# Vivado block design finn_design, xck26-sfvc784-2LV-c, Vivado 2022.2
create_bd_design finn_design

create_bd_intf_port -mode Slave -vlnv xilinx.com:interface:axis_rtl:1.0 s_axis_0
set_property -dict [list \
  CONFIG.FREQ_HZ 200000000 \
  CONFIG.HAS_TKEEP 0 \
  CONFIG.HAS_TLAST 0 \
  CONFIG.HAS_TREADY 1 \
  CONFIG.HAS_TSTRB 0 \
  CONFIG.LAYERED_METADATA undef \
  CONFIG.TDATA_NUM_BYTES 2 \
  CONFIG.TDEST_WIDTH 0 \
  CONFIG.TID_WIDTH 0 \
  CONFIG.TUSER_WIDTH 0 \
] [get_bd_intf_ports s_axis_0]
create_bd_intf_port -mode Master -vlnv xilinx.com:interface:axis_rtl:1.0 m_axis_0
set_property -dict {CONFIG.FREQ_HZ 200000000} [get_bd_intf_ports m_axis_0]
create_bd_port -dir I -type clk ap_clk
set_property -dict {CONFIG.FREQ_HZ 200000000} [get_bd_ports ap_clk]
create_bd_port -dir I -type rst ap_rst_n

create_bd_cell -type module -reference StreamingFIFO_rtl_0 StreamingFIFO_rtl_0
create_bd_cell -type module -reference FMPadding_rtl_0 FMPadding_rtl_0
create_bd_cell -type hier StreamingFIFO_rtl_1
create_bd_cell -type module -reference ConvolutionInputGenerator_rtl_0 ConvolutionInputGenerator_rtl_0
create_bd_cell -type module -reference StreamingFIFO_rtl_2 StreamingFIFO_rtl_2
create_bd_cell -type module -reference StreamingDataWidthConverter_rtl_0 StreamingDataWidthConverter_rtl_0
create_bd_cell -type module -reference StreamingFIFO_rtl_3 StreamingFIFO_rtl_3
create_bd_cell -type hier MVAU_hls_0
create_bd_cell -type module -reference StreamingFIFO_rtl_4 StreamingFIFO_rtl_4
create_bd_cell -type module -reference StreamingDataWidthConverter_rtl_1 StreamingDataWidthConverter_rtl_1
create_bd_cell -type module -reference StreamingFIFO_rtl_5 StreamingFIFO_rtl_5
create_bd_cell -type ip -vlnv xilinx.com:hls:StreamingMaxPool_hls_0:1.0 StreamingMaxPool_hls_0
create_bd_cell -type module -reference StreamingFIFO_rtl_6 StreamingFIFO_rtl_6
create_bd_cell -type module -reference FMPadding_rtl_1 FMPadding_rtl_1
create_bd_cell -type module -reference StreamingFIFO_rtl_7 StreamingFIFO_rtl_7
create_bd_cell -type module -reference StreamingDataWidthConverter_rtl_2 StreamingDataWidthConverter_rtl_2
create_bd_cell -type hier StreamingFIFO_rtl_8
create_bd_cell -type module -reference ConvolutionInputGenerator_rtl_1 ConvolutionInputGenerator_rtl_1
create_bd_cell -type module -reference StreamingFIFO_rtl_9 StreamingFIFO_rtl_9
create_bd_cell -type module -reference StreamingDataWidthConverter_rtl_3 StreamingDataWidthConverter_rtl_3
create_bd_cell -type hier StreamingFIFO_rtl_10
create_bd_cell -type hier MVAU_hls_1
create_bd_cell -type module -reference StreamingFIFO_rtl_11 StreamingFIFO_rtl_11
create_bd_cell -type module -reference StreamingDataWidthConverter_rtl_4 StreamingDataWidthConverter_rtl_4
create_bd_cell -type module -reference StreamingFIFO_rtl_12 StreamingFIFO_rtl_12
create_bd_cell -type ip -vlnv xilinx.com:hls:StreamingMaxPool_hls_1:1.0 StreamingMaxPool_hls_1
create_bd_cell -type module -reference StreamingFIFO_rtl_13 StreamingFIFO_rtl_13
create_bd_cell -type module -reference FMPadding_rtl_2 FMPadding_rtl_2
create_bd_cell -type module -reference StreamingFIFO_rtl_14 StreamingFIFO_rtl_14
create_bd_cell -type module -reference StreamingDataWidthConverter_rtl_5 StreamingDataWidthConverter_rtl_5
create_bd_cell -type module -reference StreamingFIFO_rtl_15 StreamingFIFO_rtl_15
create_bd_cell -type module -reference ConvolutionInputGenerator_rtl_2 ConvolutionInputGenerator_rtl_2
create_bd_cell -type module -reference StreamingFIFO_rtl_16 StreamingFIFO_rtl_16
create_bd_cell -type module -reference StreamingDataWidthConverter_rtl_6 StreamingDataWidthConverter_rtl_6
create_bd_cell -type hier StreamingFIFO_rtl_17
create_bd_cell -type hier MVAU_hls_2
create_bd_cell -type module -reference StreamingFIFO_rtl_18 StreamingFIFO_rtl_18
create_bd_cell -type module -reference StreamingDataWidthConverter_rtl_7 StreamingDataWidthConverter_rtl_7
create_bd_cell -type module -reference StreamingFIFO_rtl_19 StreamingFIFO_rtl_19
create_bd_cell -type ip -vlnv xilinx.com:hls:StreamingMaxPool_hls_2:1.0 StreamingMaxPool_hls_2
create_bd_cell -type module -reference StreamingFIFO_rtl_20 StreamingFIFO_rtl_20
create_bd_cell -type module -reference StreamingDataWidthConverter_rtl_8 StreamingDataWidthConverter_rtl_8
create_bd_cell -type module -reference StreamingFIFO_rtl_21 StreamingFIFO_rtl_21
create_bd_cell -type hier MVAU_hls_3
create_bd_cell -type module -reference StreamingFIFO_rtl_22 StreamingFIFO_rtl_22
create_bd_cell -type hier MVAU_rtl_0
create_bd_cell -type module -reference StreamingFIFO_rtl_23 StreamingFIFO_rtl_23

# ---- hierarchy /StreamingFIFO_rtl_1 ----
current_bd_instance /StreamingFIFO_rtl_1
create_bd_intf_pin -mode Master -vlnv xilinx.com:interface:axis_rtl:1.0 out_V
create_bd_intf_pin -mode Slave -vlnv xilinx.com:interface:axis_rtl:1.0 in0_V
create_bd_pin -dir I -type clk ap_clk
create_bd_pin -dir I -type rst ap_rst_n

create_bd_cell -type ip -vlnv xilinx.com:ip:axis_data_fifo:2.0 fifo
set_property -dict {CONFIG.FIFO_DEPTH 2048 CONFIG.FIFO_MEMORY_TYPE auto CONFIG.TDATA_NUM_BYTES 2} [get_bd_cells fifo]

# ---- hierarchy /MVAU_hls_0 ----
current_bd_instance /MVAU_hls_0
create_bd_intf_pin -mode Master -vlnv xilinx.com:interface:axis_rtl:1.0 out_V
create_bd_intf_pin -mode Slave -vlnv xilinx.com:interface:axis_rtl:1.0 in0_V
create_bd_pin -dir I -type clk ap_clk
create_bd_pin -dir I -type rst ap_rst_n

create_bd_cell -type ip -vlnv xilinx.com:hls:MVAU_hls_0:1.0 MVAU_hls_0
create_bd_cell -type ip -vlnv amd.com:finn:memstream:1.0 MVAU_hls_0_wstrm
set_property -dict [list \
  CONFIG.DEPTH 8 \
  CONFIG.INIT_FILE /tmp/finn_dev_emanuel-hernandez/code_gen_ipgen_MVAU_hls_0_khxbfrfz/memblock.dat \
  CONFIG.RAM_STYLE auto \
  CONFIG.WIDTH 72 \
] [get_bd_cells MVAU_hls_0_wstrm]

# ---- hierarchy /StreamingFIFO_rtl_8 ----
current_bd_instance /StreamingFIFO_rtl_8
create_bd_intf_pin -mode Master -vlnv xilinx.com:interface:axis_rtl:1.0 out_V
create_bd_intf_pin -mode Slave -vlnv xilinx.com:interface:axis_rtl:1.0 in0_V
create_bd_pin -dir I -type clk ap_clk
create_bd_pin -dir I -type rst ap_rst_n

create_bd_cell -type ip -vlnv xilinx.com:ip:axis_data_fifo:2.0 fifo
set_property -dict {CONFIG.FIFO_DEPTH 512 CONFIG.FIFO_MEMORY_TYPE auto CONFIG.TDATA_NUM_BYTES 2} [get_bd_cells fifo]

# ---- hierarchy /StreamingFIFO_rtl_10 ----
current_bd_instance /StreamingFIFO_rtl_10
create_bd_intf_pin -mode Master -vlnv xilinx.com:interface:axis_rtl:1.0 out_V
create_bd_intf_pin -mode Slave -vlnv xilinx.com:interface:axis_rtl:1.0 in0_V
create_bd_pin -dir I -type clk ap_clk
create_bd_pin -dir I -type rst ap_rst_n

create_bd_cell -type ip -vlnv xilinx.com:ip:axis_data_fifo:2.0 fifo
set_property -dict {CONFIG.FIFO_DEPTH 1024 CONFIG.FIFO_MEMORY_TYPE auto CONFIG.TDATA_NUM_BYTES 12} [get_bd_cells fifo]

# ---- hierarchy /MVAU_hls_1 ----
current_bd_instance /MVAU_hls_1
create_bd_intf_pin -mode Master -vlnv xilinx.com:interface:axis_rtl:1.0 out_V
create_bd_intf_pin -mode Slave -vlnv xilinx.com:interface:axis_rtl:1.0 in0_V
create_bd_pin -dir I -type clk ap_clk
create_bd_pin -dir I -type rst ap_rst_n

create_bd_cell -type ip -vlnv xilinx.com:hls:MVAU_hls_1:1.0 MVAU_hls_1
create_bd_cell -type ip -vlnv amd.com:finn:memstream:1.0 MVAU_hls_1_wstrm
set_property -dict [list \
  CONFIG.DEPTH 48 \
  CONFIG.INIT_FILE /tmp/finn_dev_emanuel-hernandez/code_gen_ipgen_MVAU_hls_1_o7qj1v51/memblock.dat \
  CONFIG.RAM_STYLE auto \
  CONFIG.WIDTH 48 \
] [get_bd_cells MVAU_hls_1_wstrm]

# ---- hierarchy /StreamingFIFO_rtl_17 ----
current_bd_instance /StreamingFIFO_rtl_17
create_bd_intf_pin -mode Master -vlnv xilinx.com:interface:axis_rtl:1.0 out_V
create_bd_intf_pin -mode Slave -vlnv xilinx.com:interface:axis_rtl:1.0 in0_V
create_bd_pin -dir I -type clk ap_clk
create_bd_pin -dir I -type rst ap_rst_n

create_bd_cell -type ip -vlnv xilinx.com:ip:axis_data_fifo:2.0 fifo
set_property -dict {CONFIG.FIFO_DEPTH 512 CONFIG.FIFO_MEMORY_TYPE auto CONFIG.TDATA_NUM_BYTES 2} [get_bd_cells fifo]

# ---- hierarchy /MVAU_hls_2 ----
current_bd_instance /MVAU_hls_2
create_bd_intf_pin -mode Master -vlnv xilinx.com:interface:axis_rtl:1.0 out_V
create_bd_intf_pin -mode Slave -vlnv xilinx.com:interface:axis_rtl:1.0 in0_V
create_bd_pin -dir I -type clk ap_clk
create_bd_pin -dir I -type rst ap_rst_n

create_bd_cell -type ip -vlnv xilinx.com:hls:MVAU_hls_2:1.0 MVAU_hls_2
create_bd_cell -type ip -vlnv amd.com:finn:memstream:1.0 MVAU_hls_2_wstrm
set_property -dict [list \
  CONFIG.DEPTH 288 \
  CONFIG.INIT_FILE /tmp/finn_dev_emanuel-hernandez/code_gen_ipgen_MVAU_hls_2_s_vi4z__/memblock.dat \
  CONFIG.RAM_STYLE auto \
  CONFIG.WIDTH 8 \
] [get_bd_cells MVAU_hls_2_wstrm]

# ---- hierarchy /MVAU_hls_3 ----
current_bd_instance /MVAU_hls_3
create_bd_intf_pin -mode Master -vlnv xilinx.com:interface:axis_rtl:1.0 out_V
create_bd_intf_pin -mode Slave -vlnv xilinx.com:interface:axis_rtl:1.0 in0_V
create_bd_pin -dir I -type clk ap_clk
create_bd_pin -dir I -type rst ap_rst_n

create_bd_cell -type ip -vlnv xilinx.com:hls:MVAU_hls_3:1.0 MVAU_hls_3
create_bd_cell -type ip -vlnv amd.com:finn:memstream:1.0 MVAU_hls_3_wstrm
set_property -dict [list \
  CONFIG.DEPTH 256 \
  CONFIG.INIT_FILE /tmp/finn_dev_emanuel-hernandez/code_gen_ipgen_MVAU_hls_3_zsxxww8f/memblock.dat \
  CONFIG.RAM_STYLE auto \
  CONFIG.WIDTH 8 \
] [get_bd_cells MVAU_hls_3_wstrm]

# ---- hierarchy /MVAU_rtl_0 ----
current_bd_instance /MVAU_rtl_0
create_bd_intf_pin -mode Master -vlnv xilinx.com:interface:axis_rtl:1.0 out_V
create_bd_intf_pin -mode Slave -vlnv xilinx.com:interface:axis_rtl:1.0 in0_V
create_bd_pin -dir I -type clk ap_clk
create_bd_pin -dir I -type rst ap_rst_n

create_bd_cell -type module -reference MVAU_rtl_0 MVAU_rtl_0
create_bd_cell -type ip -vlnv amd.com:finn:memstream:1.0 MVAU_rtl_0_wstrm
set_property -dict [list \
  CONFIG.DEPTH 160 \
  CONFIG.INIT_FILE /tmp/finn_dev_emanuel-hernandez/code_gen_ipgen_MVAU_rtl_0_3wnq5gcz/memblock.dat \
  CONFIG.RAM_STYLE auto \
  CONFIG.WIDTH 8 \
] [get_bd_cells MVAU_rtl_0_wstrm]

# ---- connections ----

current_bd_instance /StreamingFIFO_rtl_1
connect_bd_intf_net [get_bd_intf_pins out_V] [get_bd_intf_pins fifo/M_AXIS]
connect_bd_intf_net [get_bd_intf_pins in0_V] [get_bd_intf_pins fifo/S_AXIS]
connect_bd_net [get_bd_pins ap_clk] [get_bd_pins fifo/s_axis_aclk]
connect_bd_net [get_bd_pins ap_rst_n] [get_bd_pins fifo/s_axis_aresetn]

current_bd_instance /MVAU_hls_0
connect_bd_intf_net [get_bd_intf_pins out_V] [get_bd_intf_pins MVAU_hls_0/out_V]
connect_bd_intf_net [get_bd_intf_pins MVAU_hls_0_wstrm/m_axis_0] [get_bd_intf_pins MVAU_hls_0/weights_V]
connect_bd_intf_net [get_bd_intf_pins in0_V] [get_bd_intf_pins MVAU_hls_0/in0_V]
connect_bd_net [get_bd_pins ap_clk] [get_bd_pins MVAU_hls_0_wstrm/ap_clk] [get_bd_pins MVAU_hls_0/ap_clk]
connect_bd_net [get_bd_pins ap_rst_n] [get_bd_pins MVAU_hls_0_wstrm/ap_rst_n] [get_bd_pins MVAU_hls_0/ap_rst_n]

current_bd_instance /StreamingFIFO_rtl_8
connect_bd_intf_net [get_bd_intf_pins out_V] [get_bd_intf_pins fifo/M_AXIS]
connect_bd_intf_net [get_bd_intf_pins in0_V] [get_bd_intf_pins fifo/S_AXIS]
connect_bd_net [get_bd_pins ap_clk] [get_bd_pins fifo/s_axis_aclk]
connect_bd_net [get_bd_pins ap_rst_n] [get_bd_pins fifo/s_axis_aresetn]

current_bd_instance /StreamingFIFO_rtl_10
connect_bd_intf_net [get_bd_intf_pins out_V] [get_bd_intf_pins fifo/M_AXIS]
connect_bd_intf_net [get_bd_intf_pins in0_V] [get_bd_intf_pins fifo/S_AXIS]
connect_bd_net [get_bd_pins ap_clk] [get_bd_pins fifo/s_axis_aclk]
connect_bd_net [get_bd_pins ap_rst_n] [get_bd_pins fifo/s_axis_aresetn]

current_bd_instance /MVAU_hls_1
connect_bd_intf_net [get_bd_intf_pins out_V] [get_bd_intf_pins MVAU_hls_1/out_V]
connect_bd_intf_net [get_bd_intf_pins MVAU_hls_1_wstrm/m_axis_0] [get_bd_intf_pins MVAU_hls_1/weights_V]
connect_bd_intf_net [get_bd_intf_pins in0_V] [get_bd_intf_pins MVAU_hls_1/in0_V]
connect_bd_net [get_bd_pins ap_clk] [get_bd_pins MVAU_hls_1_wstrm/ap_clk] [get_bd_pins MVAU_hls_1/ap_clk]
connect_bd_net [get_bd_pins ap_rst_n] [get_bd_pins MVAU_hls_1_wstrm/ap_rst_n] [get_bd_pins MVAU_hls_1/ap_rst_n]

current_bd_instance /StreamingFIFO_rtl_17
connect_bd_intf_net [get_bd_intf_pins out_V] [get_bd_intf_pins fifo/M_AXIS]
connect_bd_intf_net [get_bd_intf_pins in0_V] [get_bd_intf_pins fifo/S_AXIS]
connect_bd_net [get_bd_pins ap_clk] [get_bd_pins fifo/s_axis_aclk]
connect_bd_net [get_bd_pins ap_rst_n] [get_bd_pins fifo/s_axis_aresetn]

current_bd_instance /MVAU_hls_2
connect_bd_intf_net [get_bd_intf_pins out_V] [get_bd_intf_pins MVAU_hls_2/out_V]
connect_bd_intf_net [get_bd_intf_pins MVAU_hls_2_wstrm/m_axis_0] [get_bd_intf_pins MVAU_hls_2/weights_V]
connect_bd_intf_net [get_bd_intf_pins in0_V] [get_bd_intf_pins MVAU_hls_2/in0_V]
connect_bd_net [get_bd_pins ap_clk] [get_bd_pins MVAU_hls_2_wstrm/ap_clk] [get_bd_pins MVAU_hls_2/ap_clk]
connect_bd_net [get_bd_pins ap_rst_n] [get_bd_pins MVAU_hls_2_wstrm/ap_rst_n] [get_bd_pins MVAU_hls_2/ap_rst_n]

current_bd_instance /MVAU_hls_3
connect_bd_intf_net [get_bd_intf_pins out_V] [get_bd_intf_pins MVAU_hls_3/out_V]
connect_bd_intf_net [get_bd_intf_pins MVAU_hls_3_wstrm/m_axis_0] [get_bd_intf_pins MVAU_hls_3/weights_V]
connect_bd_intf_net [get_bd_intf_pins in0_V] [get_bd_intf_pins MVAU_hls_3/in0_V]
connect_bd_net [get_bd_pins ap_clk] [get_bd_pins MVAU_hls_3_wstrm/ap_clk] [get_bd_pins MVAU_hls_3/ap_clk]
connect_bd_net [get_bd_pins ap_rst_n] [get_bd_pins MVAU_hls_3_wstrm/ap_rst_n] [get_bd_pins MVAU_hls_3/ap_rst_n]

current_bd_instance /MVAU_rtl_0
connect_bd_intf_net [get_bd_intf_pins out_V] [get_bd_intf_pins MVAU_rtl_0/out_V]
connect_bd_intf_net [get_bd_intf_pins MVAU_rtl_0_wstrm/m_axis_0] [get_bd_intf_pins MVAU_rtl_0/weights_V]
connect_bd_intf_net [get_bd_intf_pins in0_V] [get_bd_intf_pins MVAU_rtl_0/in0_V]
connect_bd_net [get_bd_pins ap_clk] [get_bd_pins MVAU_rtl_0_wstrm/ap_clk] [get_bd_pins MVAU_rtl_0/ap_clk]
connect_bd_net [get_bd_pins ap_rst_n] [get_bd_pins MVAU_rtl_0_wstrm/ap_rst_n] [get_bd_pins MVAU_rtl_0/ap_rst_n]

current_bd_instance /
connect_bd_intf_net [get_bd_intf_pins ConvolutionInputGenerator_rtl_0/out_V] [get_bd_intf_pins StreamingFIFO_rtl_2/in0_V]
connect_bd_intf_net [get_bd_intf_pins ConvolutionInputGenerator_rtl_1/out_V] [get_bd_intf_pins StreamingFIFO_rtl_9/in0_V]
connect_bd_intf_net [get_bd_intf_pins ConvolutionInputGenerator_rtl_2/out_V] [get_bd_intf_pins StreamingFIFO_rtl_16/in0_V]
connect_bd_intf_net [get_bd_intf_pins FMPadding_rtl_0/out_V] [get_bd_intf_pins StreamingFIFO_rtl_1/in0_V]
connect_bd_intf_net [get_bd_intf_pins FMPadding_rtl_1/out_V] [get_bd_intf_pins StreamingFIFO_rtl_7/in0_V]
connect_bd_intf_net [get_bd_intf_pins FMPadding_rtl_2/out_V] [get_bd_intf_pins StreamingFIFO_rtl_14/in0_V]
connect_bd_intf_net [get_bd_intf_pins MVAU_hls_0/out_V] [get_bd_intf_pins StreamingFIFO_rtl_4/in0_V]
connect_bd_intf_net [get_bd_intf_pins MVAU_hls_1/out_V] [get_bd_intf_pins StreamingFIFO_rtl_11/in0_V]
connect_bd_intf_net [get_bd_intf_pins MVAU_hls_2/out_V] [get_bd_intf_pins StreamingFIFO_rtl_18/in0_V]
connect_bd_intf_net [get_bd_intf_pins MVAU_hls_3/out_V] [get_bd_intf_pins StreamingFIFO_rtl_22/in0_V]
connect_bd_intf_net [get_bd_intf_pins MVAU_rtl_0/out_V] [get_bd_intf_pins StreamingFIFO_rtl_23/in0_V]
connect_bd_intf_net [get_bd_intf_pins StreamingDataWidthConverter_rtl_0/out_V] [get_bd_intf_pins StreamingFIFO_rtl_3/in0_V]
connect_bd_intf_net [get_bd_intf_pins StreamingDataWidthConverter_rtl_1/out_V] [get_bd_intf_pins StreamingFIFO_rtl_5/in0_V]
connect_bd_intf_net [get_bd_intf_pins StreamingDataWidthConverter_rtl_2/out_V] [get_bd_intf_pins StreamingFIFO_rtl_8/in0_V]
connect_bd_intf_net [get_bd_intf_pins StreamingDataWidthConverter_rtl_3/out_V] [get_bd_intf_pins StreamingFIFO_rtl_10/in0_V]
connect_bd_intf_net [get_bd_intf_pins StreamingDataWidthConverter_rtl_4/out_V] [get_bd_intf_pins StreamingFIFO_rtl_12/in0_V]
connect_bd_intf_net [get_bd_intf_pins StreamingDataWidthConverter_rtl_5/out_V] [get_bd_intf_pins StreamingFIFO_rtl_15/in0_V]
connect_bd_intf_net [get_bd_intf_pins StreamingDataWidthConverter_rtl_6/out_V] [get_bd_intf_pins StreamingFIFO_rtl_17/in0_V]
connect_bd_intf_net [get_bd_intf_pins StreamingDataWidthConverter_rtl_7/out_V] [get_bd_intf_pins StreamingFIFO_rtl_19/in0_V]
connect_bd_intf_net [get_bd_intf_pins StreamingDataWidthConverter_rtl_8/out_V] [get_bd_intf_pins StreamingFIFO_rtl_21/in0_V]
connect_bd_intf_net [get_bd_intf_pins StreamingFIFO_rtl_0/out_V] [get_bd_intf_pins FMPadding_rtl_0/in0_V]
connect_bd_intf_net [get_bd_intf_pins StreamingFIFO_rtl_10/out_V] [get_bd_intf_pins MVAU_hls_1/in0_V]
connect_bd_intf_net [get_bd_intf_pins StreamingFIFO_rtl_11/out_V] [get_bd_intf_pins StreamingDataWidthConverter_rtl_4/in0_V]
connect_bd_intf_net [get_bd_intf_pins StreamingFIFO_rtl_12/out_V] [get_bd_intf_pins StreamingMaxPool_hls_1/in0_V]
connect_bd_intf_net [get_bd_intf_pins StreamingFIFO_rtl_13/out_V] [get_bd_intf_pins FMPadding_rtl_2/in0_V]
connect_bd_intf_net [get_bd_intf_pins StreamingFIFO_rtl_14/out_V] [get_bd_intf_pins StreamingDataWidthConverter_rtl_5/in0_V]
connect_bd_intf_net [get_bd_intf_pins StreamingFIFO_rtl_15/out_V] [get_bd_intf_pins ConvolutionInputGenerator_rtl_2/in0_V]
connect_bd_intf_net [get_bd_intf_pins StreamingFIFO_rtl_16/out_V] [get_bd_intf_pins StreamingDataWidthConverter_rtl_6/in0_V]
connect_bd_intf_net [get_bd_intf_pins StreamingFIFO_rtl_17/out_V] [get_bd_intf_pins MVAU_hls_2/in0_V]
connect_bd_intf_net [get_bd_intf_pins StreamingFIFO_rtl_18/out_V] [get_bd_intf_pins StreamingDataWidthConverter_rtl_7/in0_V]
connect_bd_intf_net [get_bd_intf_pins StreamingFIFO_rtl_19/out_V] [get_bd_intf_pins StreamingMaxPool_hls_2/in0_V]
connect_bd_intf_net [get_bd_intf_pins StreamingFIFO_rtl_1/out_V] [get_bd_intf_pins ConvolutionInputGenerator_rtl_0/in0_V]
connect_bd_intf_net [get_bd_intf_pins StreamingFIFO_rtl_20/out_V] [get_bd_intf_pins StreamingDataWidthConverter_rtl_8/in0_V]
connect_bd_intf_net [get_bd_intf_pins StreamingFIFO_rtl_21/out_V] [get_bd_intf_pins MVAU_hls_3/in0_V]
connect_bd_intf_net [get_bd_intf_pins StreamingFIFO_rtl_22/out_V] [get_bd_intf_pins MVAU_rtl_0/in0_V]
connect_bd_intf_net [get_bd_intf_ports m_axis_0] [get_bd_intf_pins StreamingFIFO_rtl_23/out_V]
connect_bd_intf_net [get_bd_intf_pins StreamingFIFO_rtl_2/out_V] [get_bd_intf_pins StreamingDataWidthConverter_rtl_0/in0_V]
connect_bd_intf_net [get_bd_intf_pins StreamingFIFO_rtl_3/out_V] [get_bd_intf_pins MVAU_hls_0/in0_V]
connect_bd_intf_net [get_bd_intf_pins StreamingFIFO_rtl_4/out_V] [get_bd_intf_pins StreamingDataWidthConverter_rtl_1/in0_V]
connect_bd_intf_net [get_bd_intf_pins StreamingFIFO_rtl_5/out_V] [get_bd_intf_pins StreamingMaxPool_hls_0/in0_V]
connect_bd_intf_net [get_bd_intf_pins StreamingFIFO_rtl_6/out_V] [get_bd_intf_pins FMPadding_rtl_1/in0_V]
connect_bd_intf_net [get_bd_intf_pins StreamingFIFO_rtl_7/out_V] [get_bd_intf_pins StreamingDataWidthConverter_rtl_2/in0_V]
connect_bd_intf_net [get_bd_intf_pins StreamingFIFO_rtl_8/out_V] [get_bd_intf_pins ConvolutionInputGenerator_rtl_1/in0_V]
connect_bd_intf_net [get_bd_intf_pins StreamingFIFO_rtl_9/out_V] [get_bd_intf_pins StreamingDataWidthConverter_rtl_3/in0_V]
connect_bd_intf_net [get_bd_intf_pins StreamingMaxPool_hls_0/out_V] [get_bd_intf_pins StreamingFIFO_rtl_6/in0_V]
connect_bd_intf_net [get_bd_intf_pins StreamingMaxPool_hls_1/out_V] [get_bd_intf_pins StreamingFIFO_rtl_13/in0_V]
connect_bd_intf_net [get_bd_intf_pins StreamingMaxPool_hls_2/out_V] [get_bd_intf_pins StreamingFIFO_rtl_20/in0_V]
connect_bd_intf_net -intf_net in0_V_0_1 [get_bd_intf_ports s_axis_0] [get_bd_intf_pins StreamingFIFO_rtl_0/in0_V]
connect_bd_net -net ap_clk_0_1 [get_bd_ports ap_clk] \
  [get_bd_pins StreamingFIFO_rtl_0/ap_clk] [get_bd_pins FMPadding_rtl_0/ap_clk] [get_bd_pins StreamingFIFO_rtl_1/ap_clk] \
  [get_bd_pins ConvolutionInputGenerator_rtl_0/ap_clk] [get_bd_pins StreamingFIFO_rtl_2/ap_clk] \
  [get_bd_pins StreamingDataWidthConverter_rtl_0/ap_clk] [get_bd_pins StreamingFIFO_rtl_3/ap_clk] \
  [get_bd_pins MVAU_hls_0/ap_clk] [get_bd_pins StreamingFIFO_rtl_4/ap_clk] \
  [get_bd_pins StreamingDataWidthConverter_rtl_1/ap_clk] [get_bd_pins StreamingFIFO_rtl_5/ap_clk] \
  [get_bd_pins StreamingMaxPool_hls_0/ap_clk] [get_bd_pins StreamingFIFO_rtl_6/ap_clk] [get_bd_pins FMPadding_rtl_1/ap_clk] \
  [get_bd_pins StreamingFIFO_rtl_7/ap_clk] [get_bd_pins StreamingDataWidthConverter_rtl_2/ap_clk] \
  [get_bd_pins StreamingFIFO_rtl_8/ap_clk] [get_bd_pins ConvolutionInputGenerator_rtl_1/ap_clk] \
  [get_bd_pins StreamingFIFO_rtl_9/ap_clk] [get_bd_pins StreamingDataWidthConverter_rtl_3/ap_clk] \
  [get_bd_pins StreamingFIFO_rtl_10/ap_clk] [get_bd_pins MVAU_hls_1/ap_clk] [get_bd_pins StreamingFIFO_rtl_11/ap_clk] \
  [get_bd_pins StreamingDataWidthConverter_rtl_4/ap_clk] [get_bd_pins StreamingFIFO_rtl_12/ap_clk] \
  [get_bd_pins StreamingMaxPool_hls_1/ap_clk] [get_bd_pins StreamingFIFO_rtl_13/ap_clk] [get_bd_pins FMPadding_rtl_2/ap_clk] \
  [get_bd_pins StreamingFIFO_rtl_14/ap_clk] [get_bd_pins StreamingDataWidthConverter_rtl_5/ap_clk] \
  [get_bd_pins StreamingFIFO_rtl_15/ap_clk] [get_bd_pins ConvolutionInputGenerator_rtl_2/ap_clk] \
  [get_bd_pins StreamingFIFO_rtl_16/ap_clk] [get_bd_pins StreamingDataWidthConverter_rtl_6/ap_clk] \
  [get_bd_pins StreamingFIFO_rtl_17/ap_clk] [get_bd_pins MVAU_hls_2/ap_clk] [get_bd_pins StreamingFIFO_rtl_18/ap_clk] \
  [get_bd_pins StreamingDataWidthConverter_rtl_7/ap_clk] [get_bd_pins StreamingFIFO_rtl_19/ap_clk] \
  [get_bd_pins StreamingMaxPool_hls_2/ap_clk] [get_bd_pins StreamingFIFO_rtl_20/ap_clk] \
  [get_bd_pins StreamingDataWidthConverter_rtl_8/ap_clk] [get_bd_pins StreamingFIFO_rtl_21/ap_clk] \
  [get_bd_pins MVAU_hls_3/ap_clk] [get_bd_pins StreamingFIFO_rtl_22/ap_clk] [get_bd_pins MVAU_rtl_0/ap_clk] \
  [get_bd_pins StreamingFIFO_rtl_23/ap_clk]
connect_bd_net -net ap_rst_n_0_1 [get_bd_ports ap_rst_n] \
  [get_bd_pins StreamingFIFO_rtl_0/ap_rst_n] [get_bd_pins FMPadding_rtl_0/ap_rst_n] \
  [get_bd_pins StreamingFIFO_rtl_1/ap_rst_n] [get_bd_pins ConvolutionInputGenerator_rtl_0/ap_rst_n] \
  [get_bd_pins StreamingFIFO_rtl_2/ap_rst_n] [get_bd_pins StreamingDataWidthConverter_rtl_0/ap_rst_n] \
  [get_bd_pins StreamingFIFO_rtl_3/ap_rst_n] [get_bd_pins MVAU_hls_0/ap_rst_n] [get_bd_pins StreamingFIFO_rtl_4/ap_rst_n] \
  [get_bd_pins StreamingDataWidthConverter_rtl_1/ap_rst_n] [get_bd_pins StreamingFIFO_rtl_5/ap_rst_n] \
  [get_bd_pins StreamingMaxPool_hls_0/ap_rst_n] [get_bd_pins StreamingFIFO_rtl_6/ap_rst_n] \
  [get_bd_pins FMPadding_rtl_1/ap_rst_n] [get_bd_pins StreamingFIFO_rtl_7/ap_rst_n] \
  [get_bd_pins StreamingDataWidthConverter_rtl_2/ap_rst_n] [get_bd_pins StreamingFIFO_rtl_8/ap_rst_n] \
  [get_bd_pins ConvolutionInputGenerator_rtl_1/ap_rst_n] [get_bd_pins StreamingFIFO_rtl_9/ap_rst_n] \
  [get_bd_pins StreamingDataWidthConverter_rtl_3/ap_rst_n] [get_bd_pins StreamingFIFO_rtl_10/ap_rst_n] \
  [get_bd_pins MVAU_hls_1/ap_rst_n] [get_bd_pins StreamingFIFO_rtl_11/ap_rst_n] \
  [get_bd_pins StreamingDataWidthConverter_rtl_4/ap_rst_n] [get_bd_pins StreamingFIFO_rtl_12/ap_rst_n] \
  [get_bd_pins StreamingMaxPool_hls_1/ap_rst_n] [get_bd_pins StreamingFIFO_rtl_13/ap_rst_n] \
  [get_bd_pins FMPadding_rtl_2/ap_rst_n] [get_bd_pins StreamingFIFO_rtl_14/ap_rst_n] \
  [get_bd_pins StreamingDataWidthConverter_rtl_5/ap_rst_n] [get_bd_pins StreamingFIFO_rtl_15/ap_rst_n] \
  [get_bd_pins ConvolutionInputGenerator_rtl_2/ap_rst_n] [get_bd_pins StreamingFIFO_rtl_16/ap_rst_n] \
  [get_bd_pins StreamingDataWidthConverter_rtl_6/ap_rst_n] [get_bd_pins StreamingFIFO_rtl_17/ap_rst_n] \
  [get_bd_pins MVAU_hls_2/ap_rst_n] [get_bd_pins StreamingFIFO_rtl_18/ap_rst_n] \
  [get_bd_pins StreamingDataWidthConverter_rtl_7/ap_rst_n] [get_bd_pins StreamingFIFO_rtl_19/ap_rst_n] \
  [get_bd_pins StreamingMaxPool_hls_2/ap_rst_n] [get_bd_pins StreamingFIFO_rtl_20/ap_rst_n] \
  [get_bd_pins StreamingDataWidthConverter_rtl_8/ap_rst_n] [get_bd_pins StreamingFIFO_rtl_21/ap_rst_n] \
  [get_bd_pins MVAU_hls_3/ap_rst_n] [get_bd_pins StreamingFIFO_rtl_22/ap_rst_n] [get_bd_pins MVAU_rtl_0/ap_rst_n] \
  [get_bd_pins StreamingFIFO_rtl_23/ap_rst_n]

validate_bd_design
save_bd_design
